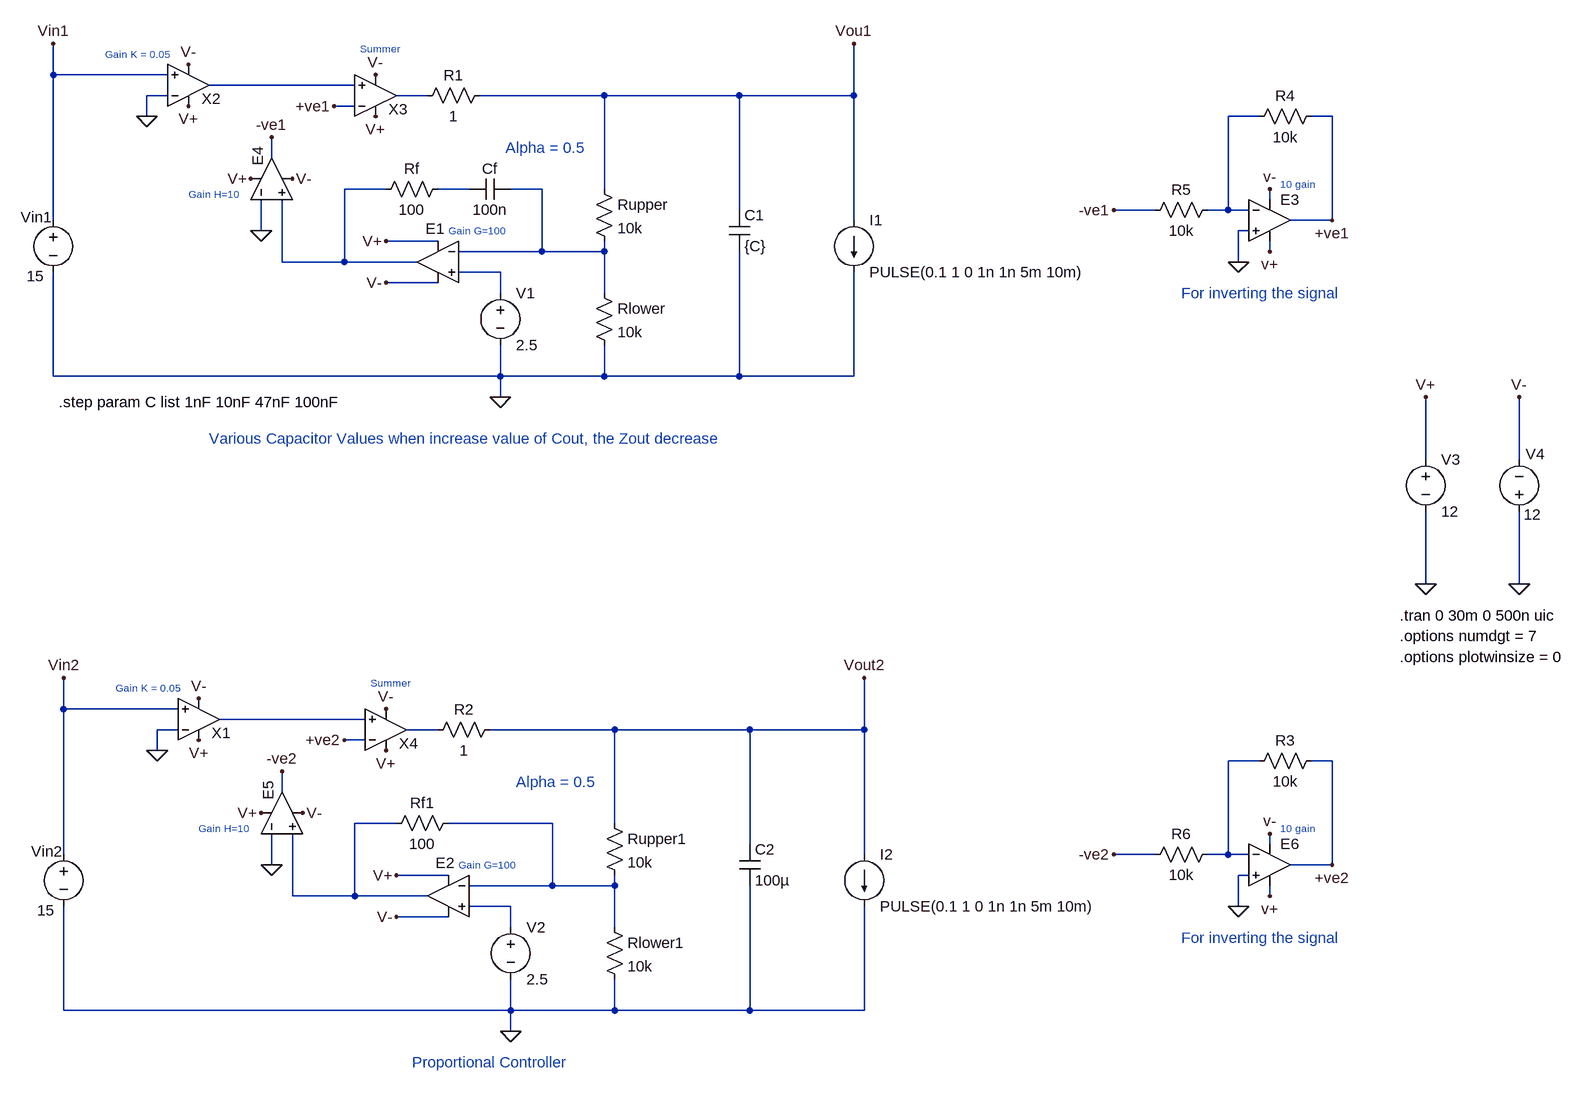
[diagram p0: schematic LDO - Closed Loop_PI and P controller.asc]
LDO - Closed Loop_PI and P controller.asc, the LTspice schematic file:
Version 4
SHEET 1 2436 2412
WIRE -416 -80 -416 -128
WIRE -240 -80 -416 -80
WIRE 48 -64 -176 -64
WIRE -240 -48 -272 -48
WIRE 160 -48 112 -48
WIRE 432 -48 240 -48
WIRE 640 -48 432 -48
WIRE 816 -48 816 -128
WIRE 816 -48 640 -48
WIRE 48 -32 16 -32
WIRE -272 -16 -272 -48
WIRE 1440 -16 1392 -16
WIRE 1552 -16 1520 -16
WIRE -80 48 -80 16
WIRE 96 96 32 96
WIRE 224 96 176 96
WIRE 336 96 288 96
WIRE 432 96 432 -48
WIRE 1456 112 1456 96
WIRE 640 128 640 -48
WIRE 1280 128 1216 128
WIRE 1392 128 1392 -16
WIRE 1392 128 1360 128
WIRE 1424 128 1392 128
WIRE -416 144 -416 -80
WIRE 816 144 816 -48
WIRE 1552 144 1552 -16
WIRE 1552 144 1488 144
WIRE -96 160 -96 112
WIRE 1424 160 1408 160
WIRE 176 176 96 176
WIRE 336 192 336 96
WIRE 336 192 208 192
WIRE 432 192 432 176
WIRE 432 192 336 192
WIRE 1456 192 1456 176
WIRE -64 208 -64 112
WIRE 32 208 32 96
WIRE 32 208 -64 208
WIRE 144 208 32 208
WIRE 1408 208 1408 160
WIRE 272 224 208 224
WIRE 176 240 96 240
WIRE 272 256 272 224
WIRE 432 256 432 192
WIRE -416 384 -416 224
WIRE 272 384 272 336
WIRE 272 384 -416 384
WIRE 432 384 432 336
WIRE 432 384 272 384
WIRE 640 384 640 192
WIRE 640 384 432 384
WIRE 816 384 816 224
WIRE 816 384 640 384
WIRE 272 416 272 384
WIRE 1696 512 1696 416
WIRE 1840 512 1840 416
WIRE 1696 704 1696 592
WIRE 1840 704 1840 592
WIRE -400 896 -400 848
WIRE -224 896 -400 896
WIRE 64 912 -160 912
WIRE -224 928 -256 928
WIRE 176 928 128 928
WIRE 448 928 256 928
WIRE 656 928 448 928
WIRE 832 928 832 848
WIRE 832 928 656 928
WIRE 64 944 32 944
WIRE -256 960 -256 928
WIRE 1440 976 1392 976
WIRE 1552 976 1520 976
WIRE -64 1024 -64 992
WIRE 112 1072 48 1072
WIRE 352 1072 192 1072
WIRE 448 1072 448 928
WIRE 656 1104 656 928
WIRE 1456 1104 1456 1088
WIRE -400 1120 -400 896
WIRE 832 1120 832 928
WIRE 1280 1120 1216 1120
WIRE 1392 1120 1392 976
WIRE 1392 1120 1360 1120
WIRE 1424 1120 1392 1120
WIRE -80 1136 -80 1088
WIRE 1552 1136 1552 976
WIRE 1552 1136 1488 1136
WIRE 192 1152 112 1152
WIRE 1424 1152 1408 1152
WIRE 352 1168 352 1072
WIRE 352 1168 224 1168
WIRE 448 1168 448 1152
WIRE 448 1168 352 1168
WIRE -48 1184 -48 1088
WIRE 48 1184 48 1072
WIRE 48 1184 -48 1184
WIRE 160 1184 48 1184
WIRE 1456 1184 1456 1168
WIRE 288 1200 224 1200
WIRE 1408 1200 1408 1152
WIRE 192 1216 112 1216
WIRE 288 1232 288 1200
WIRE 448 1232 448 1168
WIRE -400 1360 -400 1200
WIRE 288 1360 288 1312
WIRE 288 1360 -400 1360
WIRE 448 1360 448 1312
WIRE 448 1360 288 1360
WIRE 656 1360 656 1168
WIRE 656 1360 448 1360
WIRE 832 1360 832 1200
WIRE 832 1360 656 1360
WIRE 288 1392 288 1360
FLAG 96 176 V+
FLAG 96 240 V-
FLAG 1696 704 0
FLAG 1840 704 0
FLAG 1696 416 V+
FLAG 1840 416 V-
FLAG 272 416 0
FLAG 1408 208 0
FLAG 1552 144 +ve1
FLAG 1456 96 v-
FLAG 1456 192 v+
FLAG 1216 128 -ve1
FLAG -96 160 0
FLAG -112 80 V+
FLAG -48 80 V-
FLAG -80 16 -ve1
FLAG -208 -32 V+
FLAG -208 -96 V-
FLAG -272 -16 0
FLAG 80 -16 V+
FLAG 80 -80 V-
FLAG 16 -32 +ve1
FLAG 816 -128 Vou1
FLAG -416 -128 Vin1
FLAG 112 1152 V+
FLAG 112 1216 V-
FLAG 288 1392 0
FLAG -80 1136 0
FLAG -96 1056 V+
FLAG -32 1056 V-
FLAG -64 992 -ve2
FLAG -192 944 V+
FLAG -192 880 V-
FLAG -256 960 0
FLAG 96 960 V+
FLAG 96 896 V-
FLAG 32 944 +ve2
FLAG 832 848 Vout2
FLAG -400 848 Vin2
FLAG 1408 1200 0
FLAG 1552 1136 +ve2
FLAG 1456 1088 v-
FLAG 1456 1184 v+
FLAG 1216 1120 -ve2
SYMBOL voltage -416 128 R0
WINDOW 123 0 0 Left 0
WINDOW 39 0 0 Left 0
WINDOW 0 -50 11 Left 2
WINDOW 3 -41 102 Left 2
SYMATTR InstName Vin1
SYMATTR Value 15
SYMBOL voltage 272 240 R0
WINDOW 123 0 0 Left 0
WINDOW 39 0 0 Left 0
SYMATTR InstName V1
SYMATTR Value 2.5
SYMBOL res 416 80 R0
SYMATTR InstName Rupper
SYMATTR Value 10k
SYMBOL res 416 240 R0
SYMATTR InstName Rlower
SYMATTR Value 10k
SYMBOL voltage 1696 496 R0
SYMATTR InstName V3
SYMATTR Value 12
SYMBOL voltage 1840 608 R180
WINDOW 123 0 0 Left 0
WINDOW 39 0 0 Left 0
WINDOW 0 -39 104 Left 2
WINDOW 3 -34 11 Left 2
SYMATTR InstName V4
SYMATTR Value 12
SYMBOL OpAmps\\UniversalOpAmp1 1456 144 R0
SYMATTR InstName E3
SYMATTR Value2 Avol=10 GBW=10Meg Vos=0
SYMBOL res 1536 -32 R90
WINDOW 0 0 56 VBottom 2
WINDOW 3 32 56 VTop 2
SYMATTR InstName R4
SYMATTR Value 10k
SYMBOL res 1376 112 R90
WINDOW 0 0 56 VBottom 2
WINDOW 3 32 56 VTop 2
SYMATTR InstName R5
SYMATTR Value 10k
SYMBOL OpAmps\\UniversalOpAmp1 176 208 M0
WINDOW 0 -10 -51 Left 2
SYMATTR InstName E1
SYMATTR Value2 Avol=100 GBW=10Meg Vos=0
SYMBOL cap 288 80 R90
WINDOW 0 0 32 VBottom 2
WINDOW 3 32 32 VTop 2
SYMATTR InstName Cf
SYMATTR Value 100n
SYMBOL res 192 80 R90
WINDOW 0 0 56 VBottom 2
WINDOW 3 32 56 VTop 2
SYMATTR InstName Rf
SYMATTR Value 100
SYMBOL OpAmps\\UniversalOpAmp1 -80 80 R270
WINDOW 0 20 -21 Left 2
SYMATTR InstName E4
SYMATTR Value2 Avol=100 GBW=10Meg Vos=0
SYMBOL OpAmps\\UniversalOpAmp1 -208 -64 M180
WINDOW 0 20 -21 Left 2
SYMATTR InstName X2
SYMATTR Value2 Avol=0.05 GBW=10Meg Vos=0
SYMBOL OpAmps\\UniversalOpAmp1 80 -48 M180
WINDOW 0 20 -21 Left 2
SYMATTR InstName X3
SYMATTR Value2 Avol=1 GBW=10Meg Vos=0
SYMBOL res 256 -64 R90
WINDOW 0 0 56 VBottom 2
WINDOW 3 32 56 VTop 2
SYMATTR InstName R1
SYMATTR Value 1
SYMBOL cap 624 128 R0
SYMATTR InstName C1
SYMATTR Value {C}
SYMBOL current 816 144 R0
WINDOW 123 0 0 Left 0
WINDOW 39 0 0 Left 0
SYMATTR InstName I1
SYMATTR Value PULSE(0.1 1 0 1n 1n 5m 10m)
SYMBOL voltage -400 1104 R0
WINDOW 123 0 0 Left 0
WINDOW 39 0 0 Left 0
WINDOW 0 -50 11 Left 2
WINDOW 3 -41 102 Left 2
SYMATTR InstName Vin2
SYMATTR Value 15
SYMBOL voltage 288 1216 R0
WINDOW 123 0 0 Left 0
WINDOW 39 0 0 Left 0
SYMATTR InstName V2
SYMATTR Value 2.5
SYMBOL res 432 1056 R0
SYMATTR InstName Rupper1
SYMATTR Value 10k
SYMBOL res 432 1216 R0
SYMATTR InstName Rlower1
SYMATTR Value 10k
SYMBOL OpAmps\\UniversalOpAmp1 192 1184 M0
WINDOW 0 -10 -51 Left 2
SYMATTR InstName E2
SYMATTR Value2 Avol=100 GBW=10Meg Vos=0
SYMBOL res 208 1056 R90
WINDOW 0 0 56 VBottom 2
WINDOW 3 32 56 VTop 2
SYMATTR InstName Rf1
SYMATTR Value 100
SYMBOL OpAmps\\UniversalOpAmp1 -64 1056 R270
WINDOW 0 20 -21 Left 2
SYMATTR InstName E5
SYMATTR Value2 Avol=100 GBW=10Meg Vos=0
SYMBOL OpAmps\\UniversalOpAmp1 -192 912 M180
WINDOW 0 20 -21 Left 2
SYMATTR InstName X1
SYMATTR Value2 Avol=0.05 GBW=10Meg Vos=0
SYMBOL OpAmps\\UniversalOpAmp1 96 928 M180
WINDOW 0 20 -21 Left 2
SYMATTR InstName X4
SYMATTR Value2 Avol=1 GBW=10Meg Vos=0
SYMBOL res 272 912 R90
WINDOW 0 0 56 VBottom 2
WINDOW 3 32 56 VTop 2
SYMATTR InstName R2
SYMATTR Value 1
SYMBOL cap 640 1104 R0
SYMATTR InstName C2
SYMATTR Value 100µ
SYMBOL OpAmps\\UniversalOpAmp1 1456 1136 R0
SYMATTR InstName E6
SYMATTR Value2 Avol=10 GBW=10Meg Vos=0
SYMBOL res 1536 960 R90
WINDOW 0 0 56 VBottom 2
WINDOW 3 32 56 VTop 2
SYMATTR InstName R3
SYMATTR Value 10k
SYMBOL res 1376 1104 R90
WINDOW 0 0 56 VBottom 2
WINDOW 3 32 56 VTop 2
SYMATTR InstName R6
SYMATTR Value 10k
SYMBOL current 832 1120 R0
WINDOW 123 0 0 Left 0
WINDOW 39 0 0 Left 0
SYMATTR InstName I2
SYMATTR Value PULSE(0.1 1 0 1n 1n 5m 10m)
TEXT 1656 752 Left 2 !.tran 0 30m 0 500n uic
TEXT 192 160 Left 1 ;Gain G=100
TEXT 1656 784 Left 2 !.options numdgt = 7
TEXT 1656 816 Left 2 !.options plotwinsize = 0
TEXT -208 104 Left 1 ;Gain H=10
TEXT -336 -112 Left 1 ;Gain K = 0.05
TEXT 56 -120 Left 1 ;Summer
TEXT 1472 88 Left 1 ;10 gain
TEXT 280 32 Left 2 ;Alpha = 0.5
TEXT 1320 256 Left 2 ;For inverting the signal
TEXT -408 424 Left 2 !.step param C list 1nF 10nF 47nF 100nF
TEXT -176 480 Left 2 ;Various Capacitor Values when increase value of Cout, the Zout decrease
TEXT 208 1136 Left 1 ;Gain G=100
TEXT -192 1080 Left 1 ;Gain H=10
TEXT -320 864 Left 1 ;Gain K = 0.05
TEXT 72 856 Left 1 ;Summer
TEXT 296 1008 Left 2 ;Alpha = 0.5
TEXT 136 1440 Left 2 ;Proportional Controller
TEXT 1472 1080 Left 1 ;10 gain
TEXT 1320 1248 Left 2 ;For inverting the signal

The netlist it stands for:
* LDO - Closed Loop_PI and P controller.asc
Vin1 Vin1 0 15
V1 N007 0 2.5
Rupper Vou1 N006 10k
Rlower N006 0 10k
V3 V+ 0 12
V4 0 V- 12
XE3 0 N003 V- V+ +ve1 level1 Avol=10 GBW=10Meg Vos=0 En=0 Enk=0 In=0 Ink=0 Rin=500Meg  ; pins In+ In- V+ V- OUT
R4 +ve1 N003 10k
R5 N003 -ve1 10k
XE1 N007 N006 V+ V- N004 level1 Avol=100 GBW=10Meg Vos=0 En=0 Enk=0 In=0 Ink=0 Rin=500Meg  ; pins In+ In- V+ V- OUT
Cf N006 N005 100n
Rf N005 N004 100
XE4 N004 0 V+ V- -ve1 level1 Avol=100 GBW=10Meg Vos=0 En=0 Enk=0 In=0 Ink=0 Rin=500Meg  ; pins In+ In- V+ V- OUT
XX2 Vin1 0 V+ V- N001 level1 Avol=0.05 GBW=10Meg Vos=0 En=0 Enk=0 In=0 Ink=0 Rin=500Meg  ; pins In+ In- V+ V- OUT
XX3 N001 +ve1 V+ V- N002 level1 Avol=1 GBW=10Meg Vos=0 En=0 Enk=0 In=0 Ink=0 Rin=500Meg  ; pins In+ In- V+ V- OUT
R1 Vou1 N002 1
C1 Vou1 0 {C}
I1 Vou1 0 PULSE(0.1 1 0 1n 1n 5m 10m)
Vin2 Vin2 0 15
V2 N013 0 2.5
Rupper1 Vout2 N012 10k
Rlower1 N012 0 10k
XE2 N013 N012 V+ V- N011 level1 Avol=100 GBW=10Meg Vos=0 En=0 Enk=0 In=0 Ink=0 Rin=500Meg  ; pins In+ In- V+ V- OUT
Rf1 N012 N011 100
XE5 N011 0 V+ V- -ve2 level1 Avol=100 GBW=10Meg Vos=0 En=0 Enk=0 In=0 Ink=0 Rin=500Meg  ; pins In+ In- V+ V- OUT
XX1 Vin2 0 V+ V- N008 level1 Avol=0.05 GBW=10Meg Vos=0 En=0 Enk=0 In=0 Ink=0 Rin=500Meg  ; pins In+ In- V+ V- OUT
XX4 N008 +ve2 V+ V- N009 level1 Avol=1 GBW=10Meg Vos=0 En=0 Enk=0 In=0 Ink=0 Rin=500Meg  ; pins In+ In- V+ V- OUT
R2 Vout2 N009 1
C2 Vout2 0 100µ
XE6 0 N010 V- V+ +ve2 level1 Avol=10 GBW=10Meg Vos=0 En=0 Enk=0 In=0 Ink=0 Rin=500Meg  ; pins In+ In- V+ V- OUT
R3 +ve2 N010 10k
R6 N010 -ve2 10k
I2 Vout2 0 PULSE(0.1 1 0 1n 1n 5m 10m)
.tran 0 30m 0 500n uic
* Gain G=100
.options numdgt = 7
.options plotwinsize = 0
* Gain H=10
* Gain K = 0.05
* Summer
* 10 gain
* Alpha = 0.5
* For inverting the signal
.step param C list 1nF 10nF 47nF 100nF
* Various Capacitor Values when increase value of Cout, the Zout decrease
* Gain G=100
* Gain H=10
* Gain K = 0.05
* Summer
* Alpha = 0.5
* Proportional Controller
* 10 gain
* For inverting the signal
.lib UniversalOpAmp1.lib
.backanno
.end